# EAGLE design untitled (EAGLE 4.16)
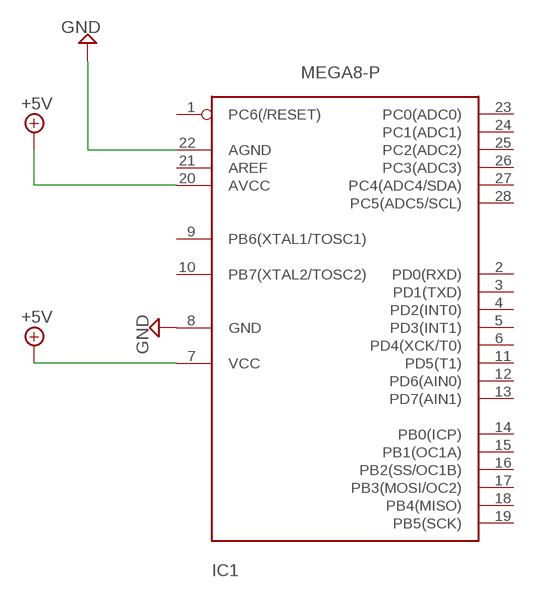
[diagram p0: schematic, sheet 1]

## Parts
IC1  MEGA8-P  [DIL28-3]

## Nets
+5V: IC1.7(VCC) IC1.20(AVCC)
GND: IC1.8(GND) IC1.22(AGND)
Unconnected: IC1.1(PC6(/RESET)) IC1.2(PD0(RXD)) IC1.3(PD1(TXD)) IC1.4(PD2(INT0)) IC1.5(PD3(INT1)) IC1.6(PD4(XCK/T0)) IC1.9(PB6(XTAL1/TOSC1)) IC1.10(PB7(XTAL2/TOSC2)) IC1.11(PD5(T1)) IC1.12(PD6(AIN0)) IC1.13(PD7(AIN1)) IC1.14(PB0(ICP)) IC1.15(PB1(OC1A)) IC1.16(PB2(SS/OC1B)) IC1.17(PB3(MOSI/OC2)) IC1.18(PB4(MISO)) IC1.19(PB5(SCK)) IC1.21(AREF) IC1.23(PC0(ADC0)) IC1.24(PC1(ADC1)) IC1.25(PC2(ADC2)) IC1.26(PC3(ADC3)) IC1.27(PC4(ADC4/SDA)) IC1.28(PC5(ADC5/SCL))

## Library data of the parts
IC1 = atmel:MEGA8-P: MICROCONTROLLER 8 Kbytes FLASH 1 kbytes SRAM 512 bytes EEPROM USART 4-channel 10 bit ADC 2-channel 8 bit ADC Source: avr.lbr

## Board
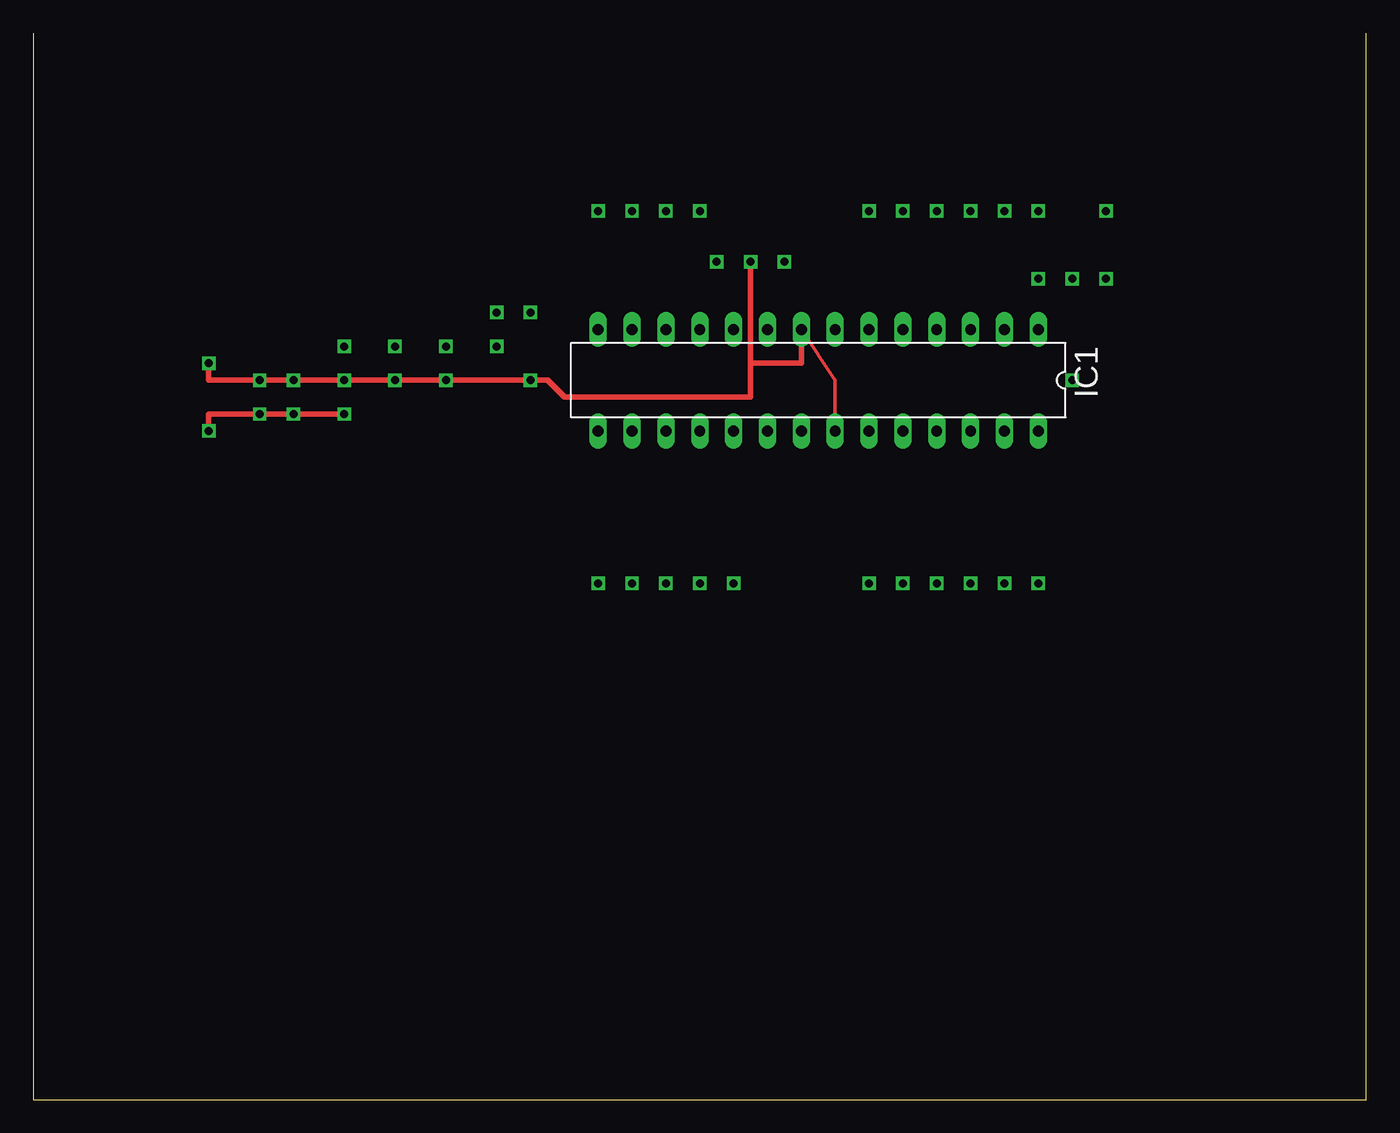
[diagram p1: board, top side]
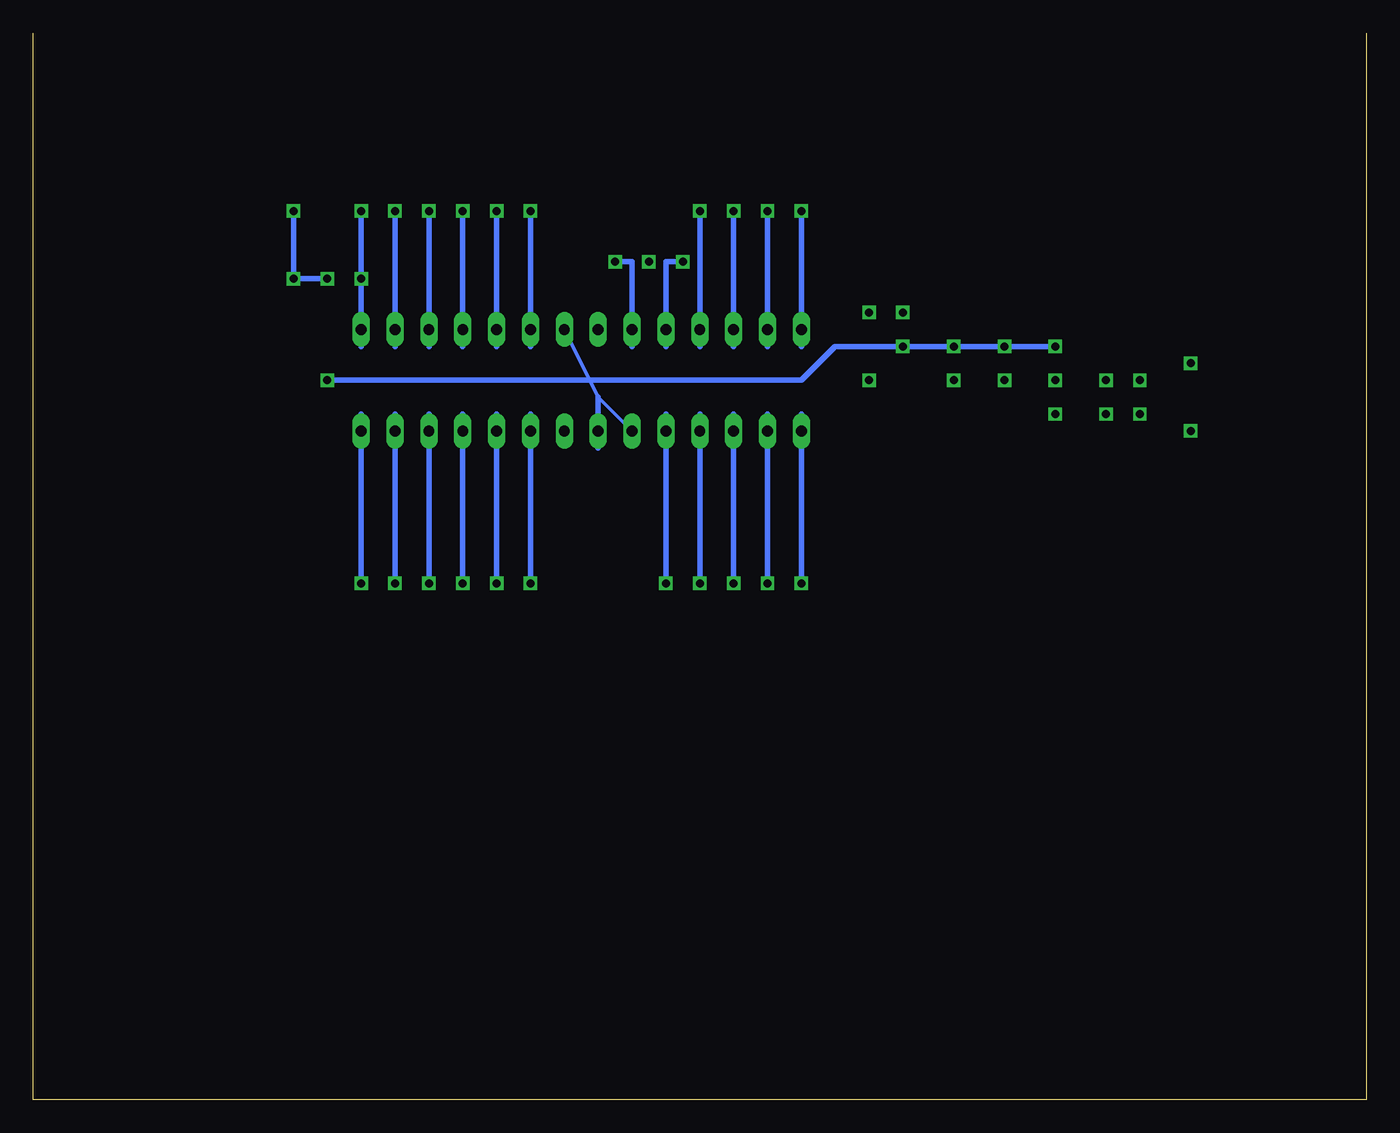
[diagram p2: board, bottom side, seen from below]

Size 100 x 80 mm. Coordinates in mm from the lower left corner, seen from the top.
Outline: 100,80 100,0 0,0 0,80
Copper layers (1*16): Top 0.035mm / dielectric 1.5mm / Bottom 0.035mm
Design rules "default": minimum track width 10mil, minimum drill 24mil, track to track 8mil, track to pad 8mil, pad to pad 8mil, via to via 8mil, smd to smd 8mil, copper to edge 40mil, drill to drill 8mil, minimum pad ring 10mil, minimum via ring 8mil, stop-mask expansion 4mil, vias tented up to drill 0mil, thermal gap 10mil

### Footprints (pad centres in the part's own frame; a part is rotated, then mirrored left to right if it is on the bottom)
DIL28-3 = drill 0.813 long: 1 -16.51,-3.81; 2 -13.97,-3.81; 3 -11.43,-3.81; 4 -8.89,-3.81; 5 -6.35,-3.81; 6 -3.81,-3.81; 7 -1.27,-3.81; 8 1.27,-3.81; 9 3.81,-3.81; 10 6.35,-3.81; 11 8.89,-3.81; 12 11.43,-3.81; 13 13.97,-3.81; 14 16.51,-3.81; 15 16.51,3.81; 16 13.97,3.81; 17 11.43,3.81; 18 8.89,3.81; 19 6.35,3.81; 20 3.81,3.81; 21 1.27,3.81; 22 -1.27,3.81; 23 -3.81,3.81; 24 -6.35,3.81; 25 -8.89,3.81; 26 -11.43,3.81; 27 -13.97,3.81; 28 -16.51,3.81

### Placement (x,y rotation side)
IC1  58.89,53.97 180 top

### Tracks (layer width: path | path; a pad name or v marks a point on that pad's centre or on a via)
+5V
  Bottom 0.254: IC1.7 57.62,52.7 IC1.20
  Bottom 0.406: 57.62,48.89 57.62,52.7
GND  (via drill 0.6)
  Top 0.254: IC1.8 60.16,53.97 IC1.22
  Top 0.406: v53.81,62.86 53.81,55.24 | 53.81,55.24 57.62,55.24 IC1.8 | v27.14,53.97 v19.52,53.97 | v27.14,53.97 v16.98,53.97 13.17,53.97 v13.17,55.24 | v27.14,53.97 v30.95,53.97 v37.3,53.97 38.57,53.97 39.84,52.7 53.81,52.7 53.81,55.24
N$2  (via drill 0.6)
  Bottom 0.406: v42.38,66.67 42.38,56.51
N$3  (via drill 0.6)
  Bottom 0.406: v44.92,66.67 44.92,56.51
N$4  (via drill 0.6)
  Bottom 0.406: v47.46,66.67 47.46,56.51
N$5  (via drill 0.6)
  Bottom 0.406: v50,66.67 50,56.51
N$6  (via drill 0.6)
  Bottom 0.406: v51.27,62.86 52.54,62.86 52.54,56.51
N$7  (via drill 0.6)
  Bottom 0.406: v56.35,62.86 55.08,62.86 55.08,56.51
N$8  (via drill 0.6)
  Bottom 0.406: v23.33,56.51 v30.95,56.51 v34.76,56.51 39.84,56.51 42.38,53.97 v77.94,53.97
N$9  (via drill 0.6)
  Bottom 0.406: v62.7,66.67 62.7,56.51
N$10  (via drill 0.6)
  Bottom 0.406: v65.24,66.67 65.24,56.51
N$11  (via drill 0.6)
  Bottom 0.406: v67.78,66.67 67.78,56.51
N$12  (via drill 0.6)
  Bottom 0.406: v70.32,66.67 70.32,56.51
N$13  (via drill 0.6)
  Bottom 0.406: 42.38,51.43 v42.38,38.73
N$14  (via drill 0.6)
  other vias: 23.33,53.97
N$15  (via drill 0.6)
  Top 0.406: v23.33,51.43 v16.98,51.43 13.17,51.43 v13.17,50.16
N$16  (via drill 0.6)
  Bottom 0.406: v72.86,66.67 72.86,56.51
N$17  (via drill 0.6)
  Bottom 0.406: 44.92,51.43 v44.92,38.73
N$18  (via drill 0.6)
  other vias: 19.52,51.43
N$19  (via drill 0.6)
  Bottom 0.406: 47.46,51.43 v47.46,38.73
N$20  (via drill 0.6)
  other vias: 27.14,56.51
N$21  (via drill 0.6)
  Bottom 0.406: 75.4,56.51 v75.4,61.59 v75.4,66.67
N$22  (via drill 0.6)
  Bottom 0.406: v77.94,61.59 v80.48,61.59 v80.48,66.67
N$23  (via drill 0.6)
  Bottom 0.406: v50,38.73 50,51.43
N$24  (via drill 0.6)
  Bottom 0.406: v52.54,38.73 52.54,51.43
N$25  (via drill 0.6)
  Bottom 0.406: 62.7,51.43 v62.7,38.73
N$26  (via drill 0.6)
  Bottom 0.406: 65.24,51.43 v65.24,38.73
N$27  (via drill 0.6)
  Bottom 0.406: 67.78,51.43 v67.78,38.73
N$28  (via drill 0.6)
  Bottom 0.406: 70.32,51.43 v70.32,38.73
N$29  (via drill 0.6)
  Bottom 0.406: 72.86,51.43 v72.86,38.73
N$30  (via drill 0.6)
  Bottom 0.406: 75.4,51.43 v75.4,38.73
N$31  (via drill 0.6)
  other vias: 37.3,59.05
N$32  (via drill 0.6)
  other vias: 34.76,59.05